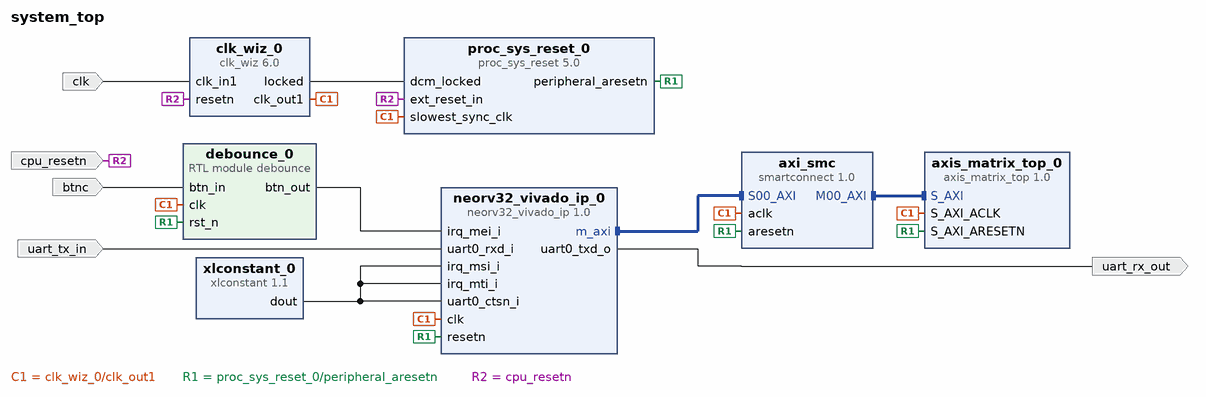
[diagram p0: block diagram of the top level]
# Vivado block design system_top, xc7a200tsbg484-1, Vivado 2025.1
create_bd_design system_top

create_bd_port -dir I -type rst cpu_resetn
set_property -dict {CONFIG.POLARITY ACTIVE_LOW} [get_bd_ports cpu_resetn]
create_bd_port -dir O uart_rx_out
create_bd_port -dir I -type clk clk
set_property -dict {CONFIG.FREQ_HZ 100000000 CONFIG.PHASE 0.0} [get_bd_ports clk]
create_bd_port -dir I uart_tx_in
create_bd_port -dir I btnc

create_bd_cell -type ip -vlnv NEORV32:user:neorv32_vivado_ip:1.0 neorv32_vivado_ip_0
set_property -dict [list \
  CONFIG.DMEM_EN true \
  CONFIG.DMEM_SIZE 65536 \
  CONFIG.IMEM_EN true \
  CONFIG.IMEM_SIZE 65536 \
  CONFIG.IO_CLINT_EN false \
  CONFIG.IO_UART0_EN true \
  CONFIG.XBUS_EN true \
] [get_bd_cells neorv32_vivado_ip_0]
create_bd_cell -type ip -vlnv xilinx.com:ip:clk_wiz:6.0 clk_wiz_0
set_property -dict [list \
  CONFIG.CLK_IN1_BOARD_INTERFACE sys_clock \
  CONFIG.ENABLE_CLOCK_MONITOR false \
  CONFIG.PRIMITIVE MMCM \
  CONFIG.RESET_BOARD_INTERFACE Custom \
  CONFIG.RESET_PORT resetn \
  CONFIG.RESET_TYPE ACTIVE_LOW \
  CONFIG.USE_BOARD_FLOW true \
] [get_bd_cells clk_wiz_0]
create_bd_cell -type ip -vlnv xilinx.com:ip:proc_sys_reset:5.0 proc_sys_reset_0
set_property -dict {CONFIG.RESET_BOARD_INTERFACE reset CONFIG.USE_BOARD_FLOW true} [get_bd_cells proc_sys_reset_0]
create_bd_cell -type ip -vlnv xilinx.com:ip:xlconstant:1.1 xlconstant_0
set_property -dict {CONFIG.CONST_VAL 0} [get_bd_cells xlconstant_0]
create_bd_cell -type ip -vlnv xilinx.com:ip:smartconnect:1.0 axi_smc
set_property -dict {CONFIG.NUM_SI 1} [get_bd_cells axi_smc]
create_bd_cell -type module -reference debounce debounce_0
create_bd_cell -type ip -vlnv xilinx.com:user:axis_matrix_top:1.0 axis_matrix_top_0

# ---- connections ----

connect_bd_intf_net [get_bd_intf_pins axi_smc/M00_AXI] [get_bd_intf_pins axis_matrix_top_0/S_AXI]
connect_bd_intf_net [get_bd_intf_pins neorv32_vivado_ip_0/m_axi] [get_bd_intf_pins axi_smc/S00_AXI]
connect_bd_net -net btn_in_0_1 [get_bd_ports btnc] [get_bd_pins debounce_0/btn_in]
connect_bd_net [get_bd_pins clk_wiz_0/clk_out1] \
  [get_bd_pins proc_sys_reset_0/slowest_sync_clk] [get_bd_pins neorv32_vivado_ip_0/clk] [get_bd_pins axi_smc/aclk] \
  [get_bd_pins debounce_0/clk] [get_bd_pins axis_matrix_top_0/S_AXI_ACLK]
connect_bd_net [get_bd_pins clk_wiz_0/locked] [get_bd_pins proc_sys_reset_0/dcm_locked]
connect_bd_net [get_bd_pins debounce_0/btn_out] [get_bd_pins neorv32_vivado_ip_0/irq_mei_i]
connect_bd_net [get_bd_pins neorv32_vivado_ip_0/uart0_txd_o] [get_bd_ports uart_rx_out]
connect_bd_net [get_bd_pins proc_sys_reset_0/peripheral_aresetn] \
  [get_bd_pins neorv32_vivado_ip_0/resetn] [get_bd_pins axi_smc/aresetn] [get_bd_pins debounce_0/rst_n] \
  [get_bd_pins axis_matrix_top_0/S_AXI_ARESETN]
connect_bd_net -net reset_1 [get_bd_ports cpu_resetn] [get_bd_pins proc_sys_reset_0/ext_reset_in] [get_bd_pins clk_wiz_0/resetn]
connect_bd_net -net sys_clock_1 [get_bd_ports clk] [get_bd_pins clk_wiz_0/clk_in1]
connect_bd_net -net uart0_rxd_i_0_1 [get_bd_ports uart_tx_in] [get_bd_pins neorv32_vivado_ip_0/uart0_rxd_i]
connect_bd_net [get_bd_pins xlconstant_0/dout] \
  [get_bd_pins neorv32_vivado_ip_0/uart0_ctsn_i] [get_bd_pins neorv32_vivado_ip_0/irq_mti_i] \
  [get_bd_pins neorv32_vivado_ip_0/irq_msi_i]

# ---- address map ----
assign_bd_address -offset 0x40000000 -range 4K -target_address_space [get_bd_addr_spaces neorv32_vivado_ip_0/m_axi] [get_bd_addr_segs axis_matrix_top_0/S_AXI/reg0]

validate_bd_design
save_bd_design
